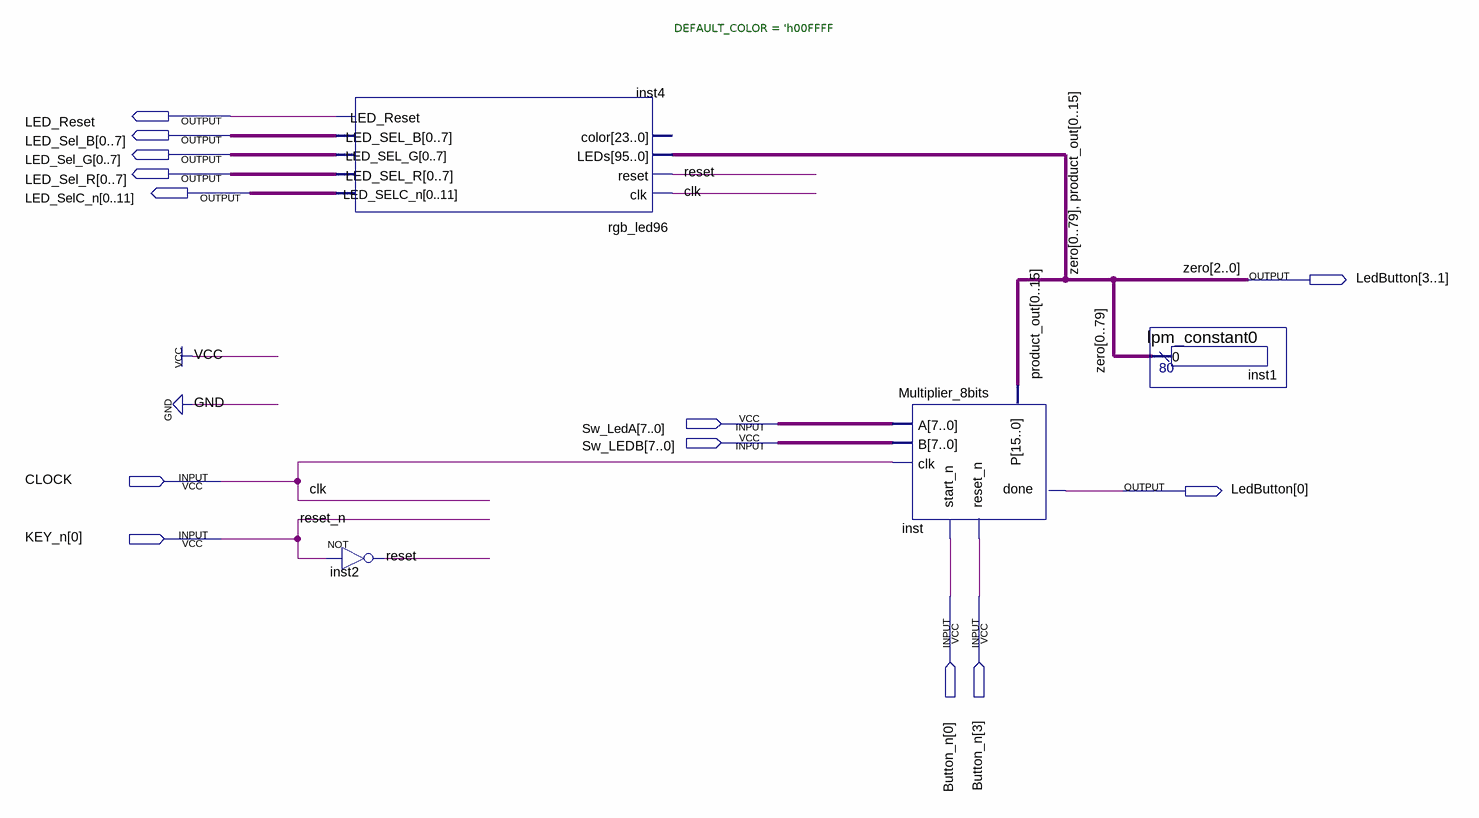
[diagram p0: schematic sheet]
// Quartus schematic Multiplier_8bits_DE0.bdf as structural Verilog: 4 symbols, 13 pins
module Multiplier_8bits_DE0 (
  input  [7:0] Sw_LedA,
  input  [7:0] Sw_LEDB,
  input  CLOCK,
  input  [0:0] KEY_n,
  input  [3:0] Button_n,
  output LED_Reset,
  output [0:7] LED_Sel_B,
  output [0:7] LED_Sel_G,
  output [0:7] LED_Sel_R,
  output [0:11] LED_SelC_n,
  output [3:0] LedButton
);

  wire reset;
  wire [15:0] product_out;
  wire [79:3] zero;

  rgb_led96 #(.DEFAULT_COLOR('h00FFFF)) inst4 (
    .clk(CLOCK), .reset(reset),
    .LEDs({LedButton[1], LedButton[2], LedButton[3], zero[3], zero[4], zero[5], zero[6], zero[7], zero[8], zero[9], zero[10], zero[11], zero[12], zero[13], zero[14], zero[15], zero[16], zero[17], zero[18], zero[19], zero[20], zero[21], zero[22], zero[23], zero[24], zero[25], zero[26], zero[27], zero[28], zero[29], zero[30], zero[31], zero[32], zero[33], zero[34], zero[35], zero[36], zero[37], zero[38], zero[39], zero[40], zero[41], zero[42], zero[43], zero[44], zero[45], zero[46], zero[47], zero[48], zero[49], zero[50], zero[51], zero[52], zero[53], zero[54], zero[55], zero[56], zero[57], zero[58], zero[59], zero[60], zero[61], zero[62], zero[63], zero[64], zero[65], zero[66], zero[67], zero[68], zero[69], zero[70], zero[71], zero[72], zero[73], zero[74], zero[75], zero[76], zero[77], zero[78], zero[79], product_out[0], product_out[1], product_out[2], product_out[3], product_out[4], product_out[5], product_out[6], product_out[7], product_out[8], product_out[9], product_out[10], product_out[11], product_out[12], product_out[13], product_out[14], product_out[15]}),
    .LED_SELC_n(LED_SelC_n), .LED_SEL_R(LED_Sel_R), .LED_SEL_G(LED_Sel_G), .LED_SEL_B(LED_Sel_B),
    .LED_Reset(LED_Reset));  // open: color
  not inst2 (reset, KEY_n[0]);
  Multiplier_8bits inst (
    .A(Sw_LedA), .B(Sw_LEDB), .clk(CLOCK), .reset_n(Button_n[3]), .start_n(Button_n[0]), .done(LedButton[0]),
    .P({product_out[0], product_out[1], product_out[2], product_out[3], product_out[4], product_out[5], product_out[6], product_out[7], product_out[8], product_out[9], product_out[10], product_out[11], product_out[12], product_out[13], product_out[14], product_out[15]}));
  lpm_constant0 inst1 (.result({LedButton[1], LedButton[2], LedButton[3], zero[3], zero[4], zero[5], zero[6], zero[7], zero[8], zero[9], zero[10], zero[11], zero[12], zero[13], zero[14], zero[15], zero[16], zero[17], zero[18], zero[19], zero[20], zero[21], zero[22], zero[23], zero[24], zero[25], zero[26], zero[27], zero[28], zero[29], zero[30], zero[31], zero[32], zero[33], zero[34], zero[35], zero[36], zero[37], zero[38], zero[39], zero[40], zero[41], zero[42], zero[43], zero[44], zero[45], zero[46], zero[47], zero[48], zero[49], zero[50], zero[51], zero[52], zero[53], zero[54], zero[55], zero[56], zero[57], zero[58], zero[59], zero[60], zero[61], zero[62], zero[63], zero[64], zero[65], zero[66], zero[67], zero[68], zero[69], zero[70], zero[71], zero[72], zero[73], zero[74], zero[75], zero[76], zero[77], zero[78], zero[79]}));

  // Other names for the same wires on the sheet: clk = CLOCK; reset_n = KEY_n[0]; zero[2:0] = LedButton[3:1]
endmodule
